# EasyEDA schematic 6coils-blue-v3-simulation.json
TITLE: Sheet_1; REV: 1.0; Date: 2024-01-02; Sheet: 1/1; Company: Your Company
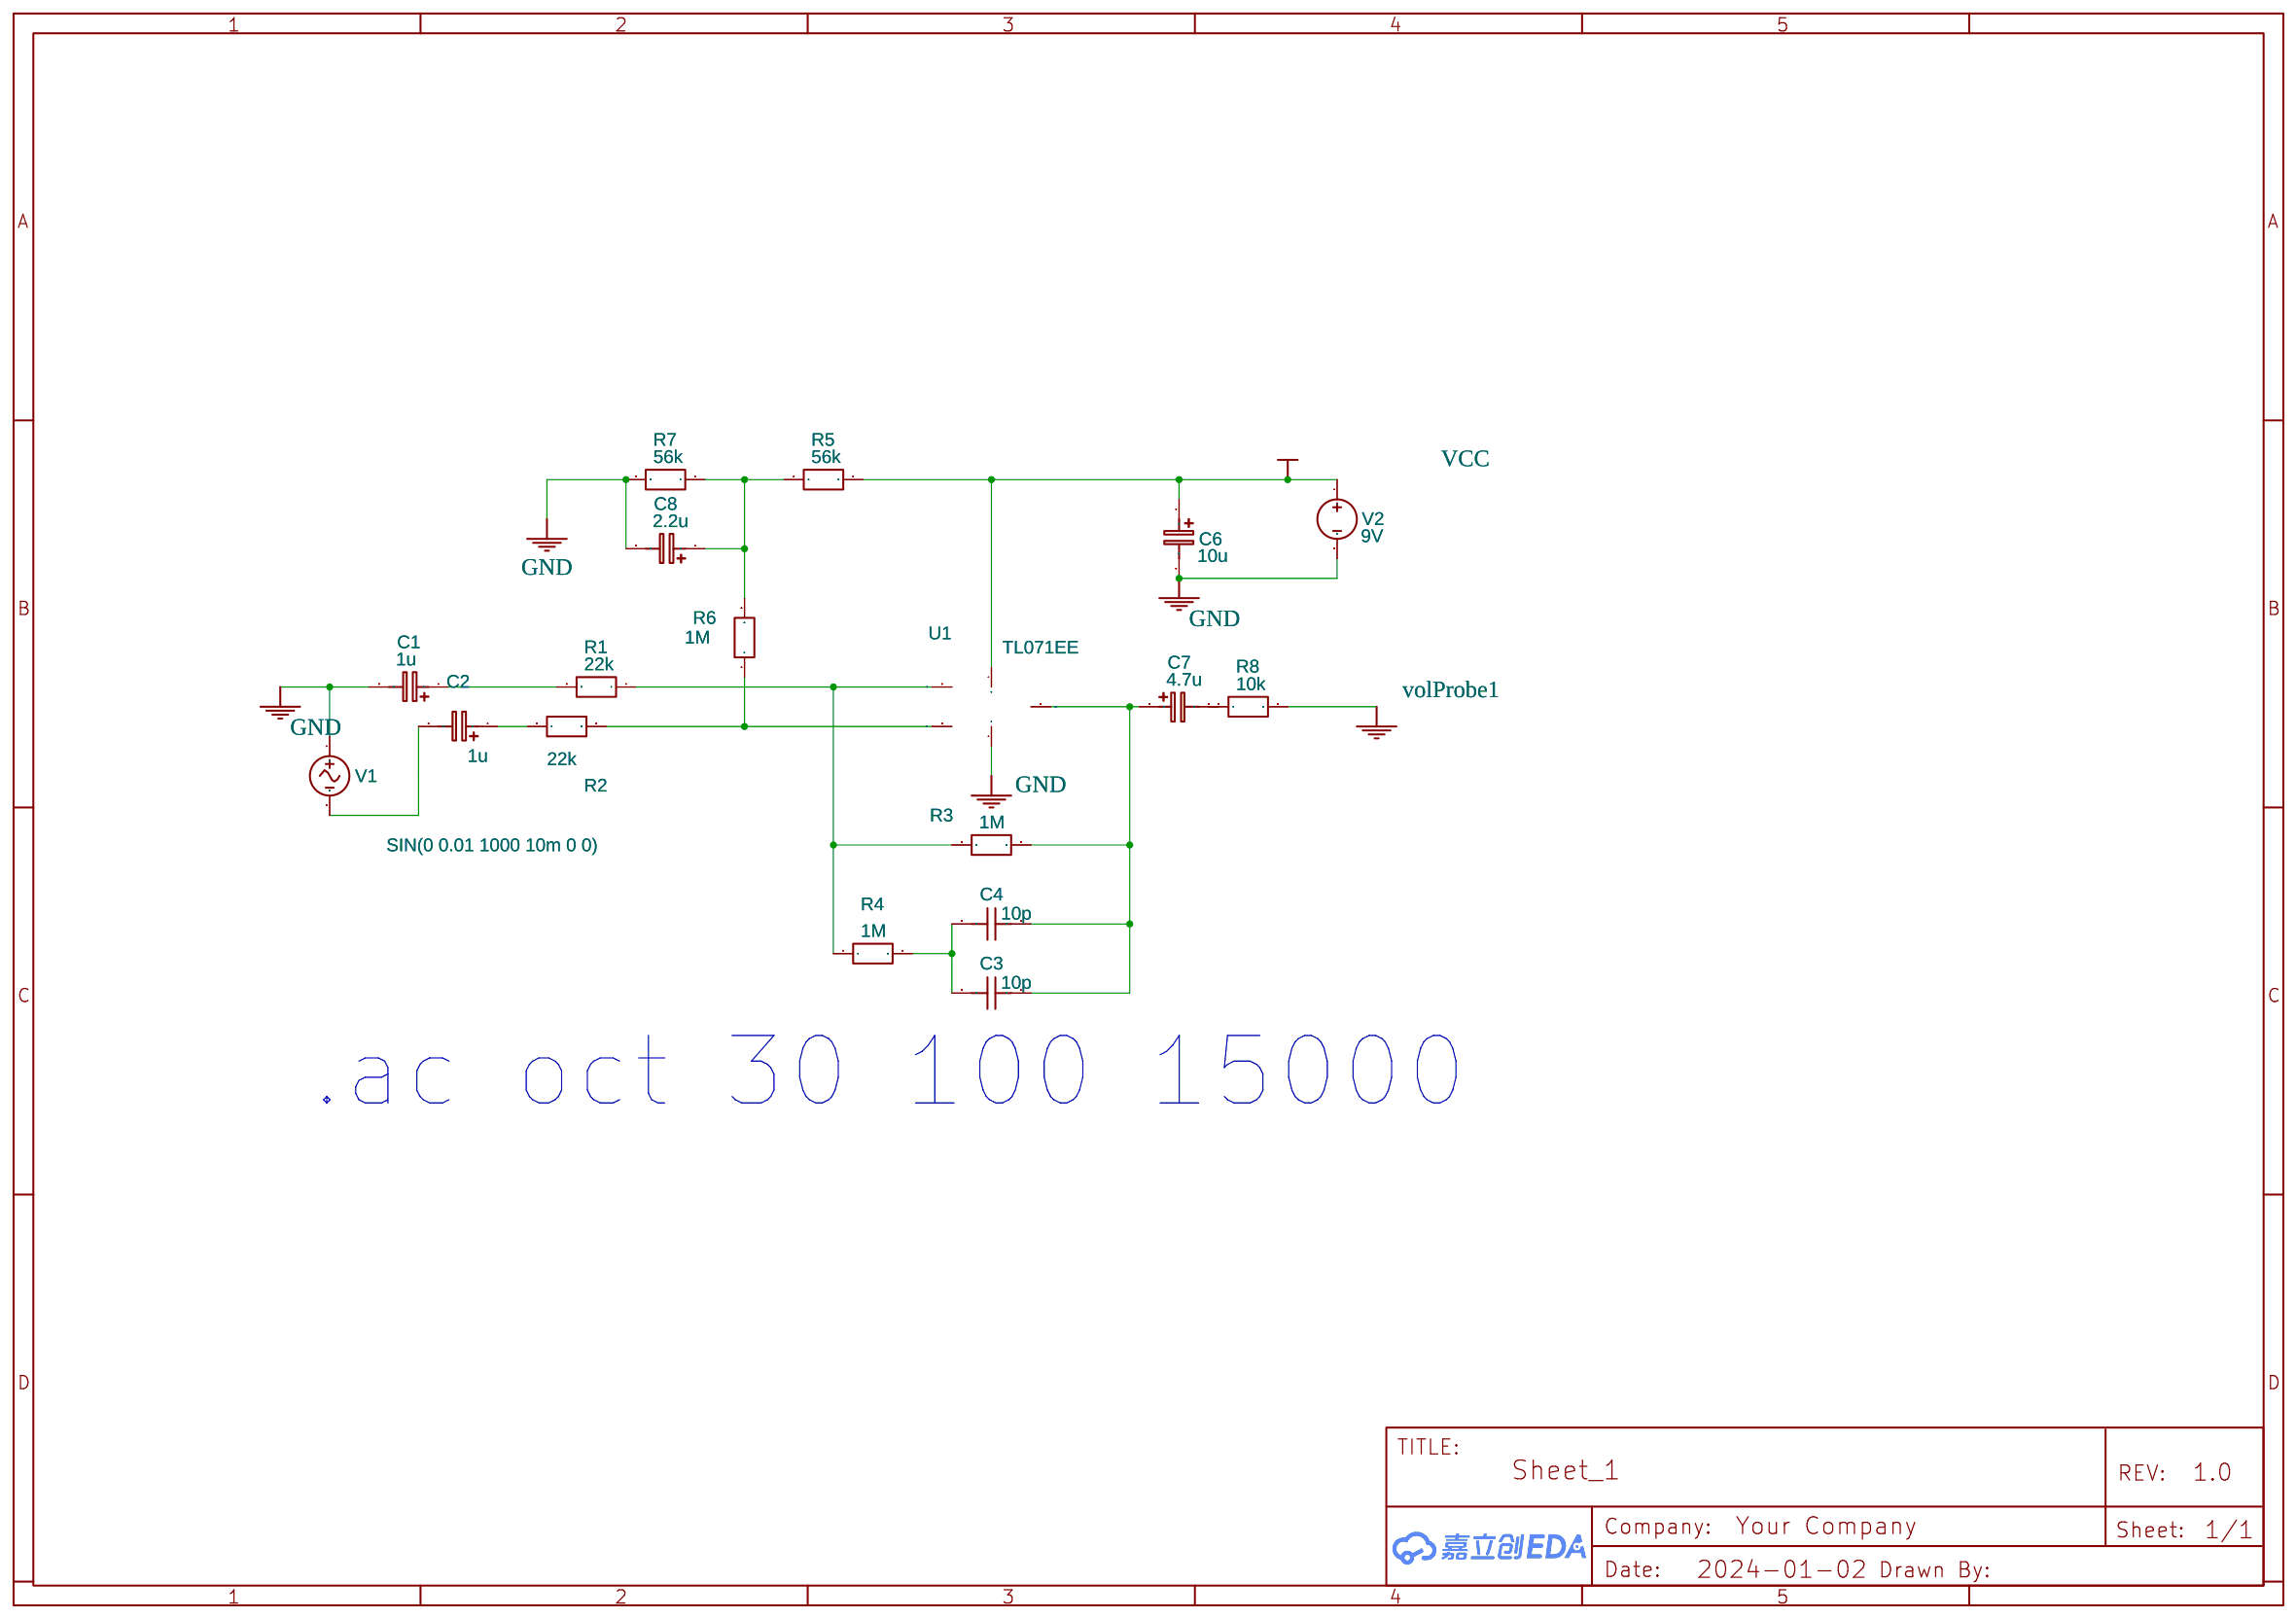
[diagram p0: schematic sheet]

## Parts
C1  1u  [CASE-A_3216]
C2  1u  [CASE-A_3216]
C3  10p  [CASE-A_3216]
C4  10p  [CASE-A_3216]
C6  10u  [CASE-A_3216]
C7  4.7u  [CASE-A_3216]
C8  2.2u  [CASE-A_3216]
R1  22k  [R0603]
R2  22k  [R0603]
R3  1M  [R0603]
R4  1M  [R0603]
R5  56k  [R0603]
R6  1M  [R0603]
R7  56k  [R0603]
R8  10k  [R0603]
U1  TL071EE  [?]
V1  SIN(0 0.01 1000 10m 0 0)  [HDR1X2]
V2  9V  [HDR1X2]

## Library data of the parts
C1 C2 C6-C8 = C_Tan_SMD_A_EU: Contributor: LCEDA_Lib
C3 C4 = Capacitor_US: Contributor: EasyEDA; Supplier: YUJING; Capacitance: 1u
R1-R8 = R_0603_EU: Contributor: LCEDA_Lib
U1 = TL071EE: Contributor: andyfierman; sim: true
V1 = VSin: Contributor: EasyEDA; sim: true; AC_Amplitude: 0.01; AC_Phase: 0
V2 = VDC: Contributor: EasyEDA; sim: true

## Nets
GND: C1.2 C6.2 C8.2 R7.2 U1.4(V-) V1.1 V2.2
VCC: C6.1 R5.1 U1.7(V+) V2.1
volProbe1: R8.2
Net-(C1-1): C1.1 R1.2
Net-(C2-1): C2.1 R2.2
Net-(C2-2): C2.2 V1.2
Net-(C3-1): C3.1 C4.1 C7.1 R3.2 U1.6(OUT)
Net-(C3-2): C3.2 C4.2 R4.2
Net-(C7-2): C7.2 R8.1
Net-(C8-1): C8.1 R5.2 R6.2 R7.1
Net-(R1-1): R1.1 R3.1 R4.1 U1.2(IN-)
Net-(R2-1): R2.1 R6.1 U1.3(IN+)

## Notes on the sheet
- .ac oct 30 100 15000
